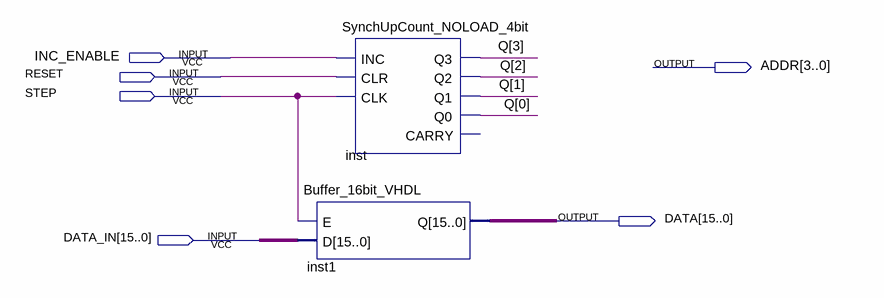
[diagram p0: schematic sheet]
// Quartus schematic ram_programmer_16bit.bdf as structural Verilog: 2 symbols, 6 pins
module ram_programmer_16bit (
  input  INC_ENABLE,
  input  RESET,
  input  STEP,
  input  [15:0] DATA_IN,
  output [3:0] ADDR,
  output [15:0] DATA
);

  wire [3:0] Q;

  Buffer_16bit_VHDL inst1 (.E(STEP), .D(DATA_IN), .Q(DATA));
  SynchUpCount_NOLOAD_4bit inst (
    .INC(INC_ENABLE), .CLR(RESET), .CLK(STEP), .Q3(Q[3]), .Q2(Q[2]), .Q1(Q[1]), .Q0(Q[0]));  // open: CARRY
endmodule
